# EAGLE design lp_small (EAGLE 7.5.0)
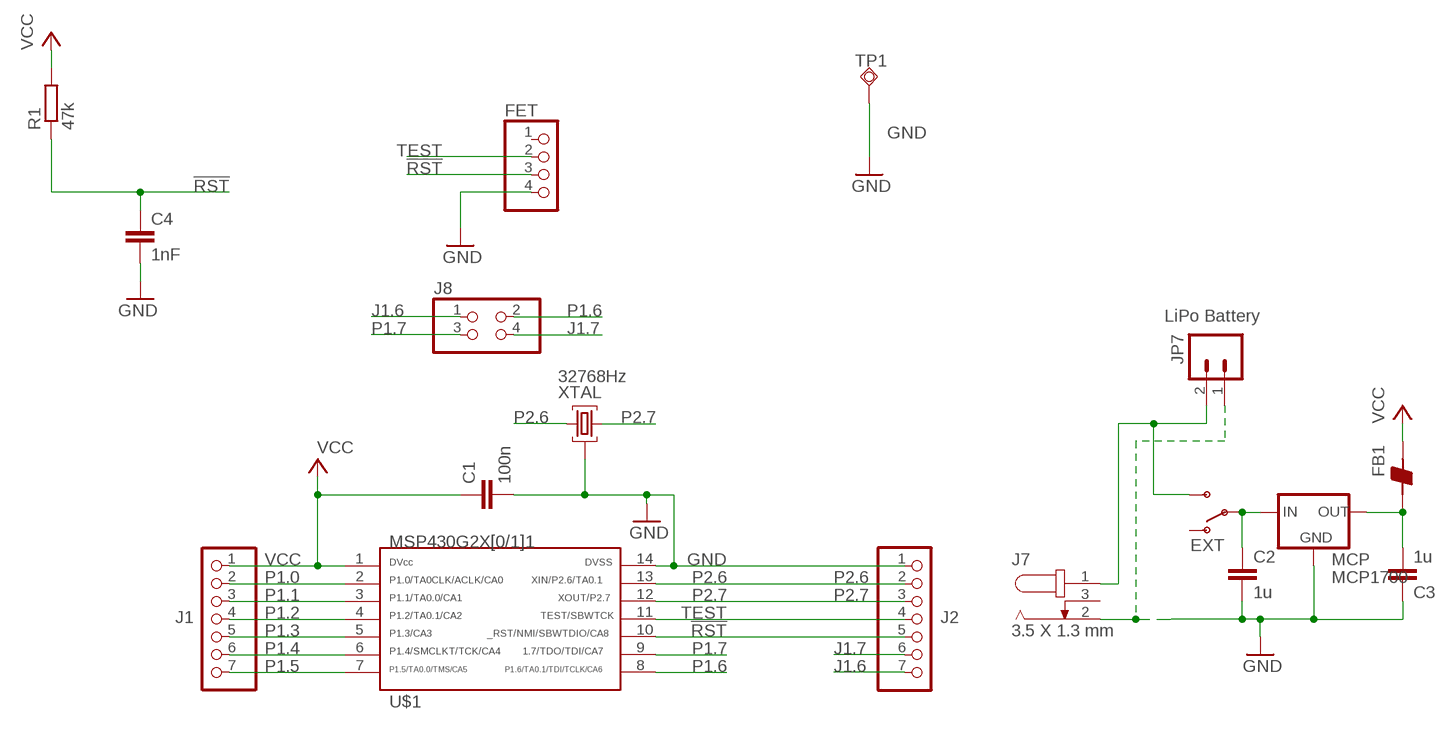
[diagram p0: schematic, sheet 1]

## Parts
C1  100n  C-EUC0805  [C0805]
C2  1u  C-EUC0805  [C0805]
C3  1u  C-EUC0805  [C0805]
C4  1nF  C-EUC0805  [C0805]
FB1  BEAD-0805  [0805]
FET  PINHD-1X4  [1X04]
J1  PINHD-1X7  [1X07]
J2  PINHD-1X7  [1X07]
J7  3.5 X 1.3 mm  DC_JACK_3.5X1.3MM  [3.5X1.3MM_DC_JACK]
J8  PINHD-2X2  [2X02]
JP7  LiPo Battery  M02JST-PTH-2  [JST-2-PTH]
MCP  MCP1700  MCP1700SOT-23  [SOT-23]
ON  EXT  SWITCH-SPSTPTH  [SWITCH-SPDT]
R1  47k  R-EU_R0805  [R0805]
TP1  TPSQTP20R  [TP20R]
U$1  G2X[0/1]1---N14  [N14]
XTAL  32768Hz  QUARZ5  [QUARZ5]

## Nets
!RST: C4.1 FET.3 J2.5 R1.1 U$1.10
GND [GND]: C1.2 C2.2 C3.1 C4.2 FET.4 J2.1 J7.2 JP7.1 MCP.1(GND) TP1.TP U$1.14 XTAL.GND@0
J1.6: J2.7 J8.1
J1.7: J2.6 J8.4
N$3 [VCC]: C2.1 MCP.3(IN) ON.2(P)
N$6 [VCC]: C3.2 FB1.1 MCP.2(OUT)
P1.0: J1.2 U$1.2
P1.1: J1.3 U$1.3
P1.2: J1.4 U$1.4
P1.3: J1.5 U$1.5
P1.4: J1.6 U$1.6
P1.5: J1.7 U$1.7
P1.6: J8.2 U$1.8
P1.7: J8.3 U$1.9
P2.6: J2.2 U$1.13 XTAL.2
P2.7: J2.3 U$1.12 XTAL.1
TEST: FET.2 J2.4 U$1.11
VCC [VCC]: C1.1 FB1.2 J1.1 R1.2 U$1.1
VCCEXT [VCC]: J7.1 JP7.2 ON.3(S)
Unconnected: FET.1 J7.3 ON.1(O)

## Library data of the parts
C1-C3 = rcl:C-EU: CAPACITOR, European symbol
C4 = resistor:C-EU: CAPACITOR, European symbol
FB1 = CH_passive:BEAD
FET = pinhead:PINHD-1X4: PIN HEADER
J1 J2 = pinhead:PINHD-1X7: PIN HEADER
J7 = MY_CONN:DC_JACK_3.5X1.3MM
J8 = pinhead:PINHD-2X2: PIN HEADER
JP7 = SparkFun:M02: Header 2 Standard 2-pin 0.1" header. Use with straight break away headers (SKU : PRT-00116), right angle break away headers (PRT-00553), swiss pins (PRT-00743), machine pins (PRT-00117), and female headers (PRT-00115). Molex polarized connector foot print use with SKU : PRT-08233 with associated crimp pins and housings.
MCP = MY_IC:MCP1700
ON = SparkFun:SWITCH-SPST: SPST Switch Simple slide switch. Spark Fun Electronics SKU : COM-00102
R1 = resistor:R-EU_: RESISTOR, European symbol
TP1 = testpad:TPSQ: Test pad
U$1 = TI_MSP430_v16:G2X[0/1]1---N14: MSP430G2X[0/1]1 MSP430G2001, MSP430G2101, MSP430G2201,MSP430G2111, G2211 PDIP (N) 14 Pin Package http://focus.ti.com/docs/prod/folders/print/msp430g2111.html
XTAL = my_xtal:QUARZ5

## Net classes
0 default: width 0.406 mm, drill 0.508 mm
1 GND: width 0.508 mm, drill 0.508 mm
2 VCC: width 1.016 mm, drill 0.508 mm
4 VCCEXT: width 0.762 mm, drill 0.508 mm, clearance 0.229 mm

## Board
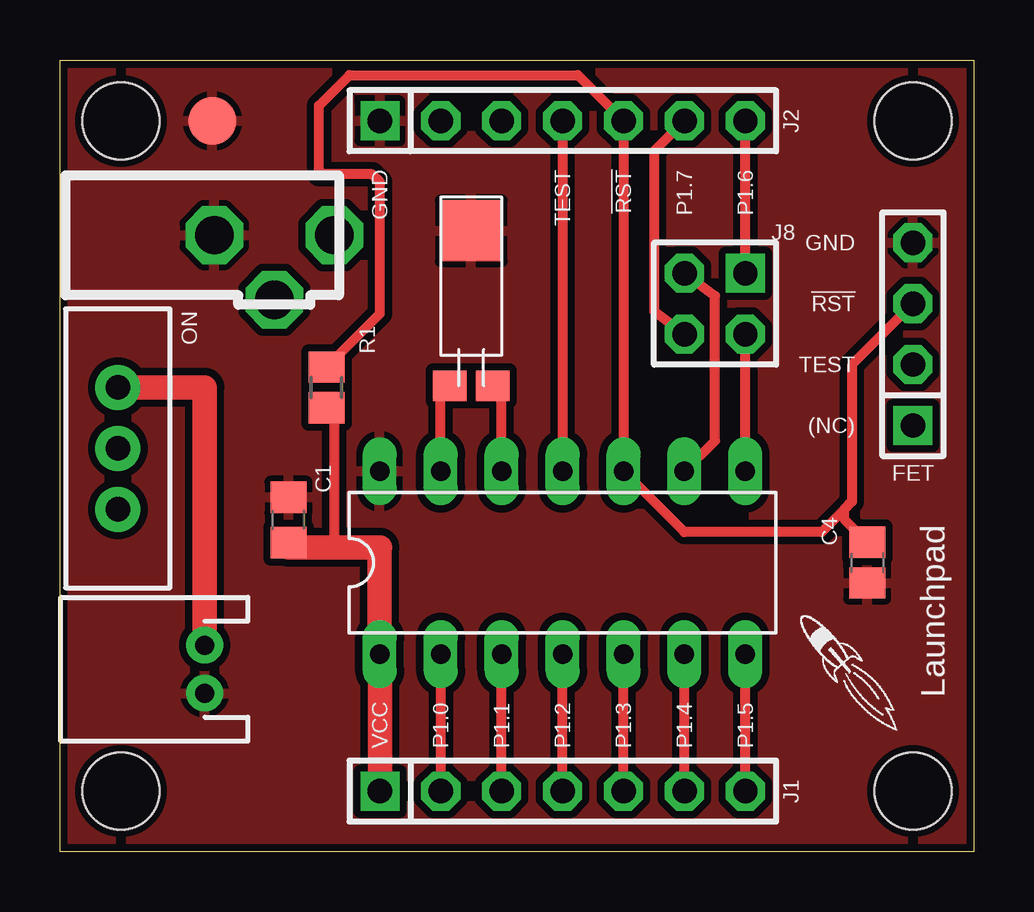
[diagram p1: board, top side]
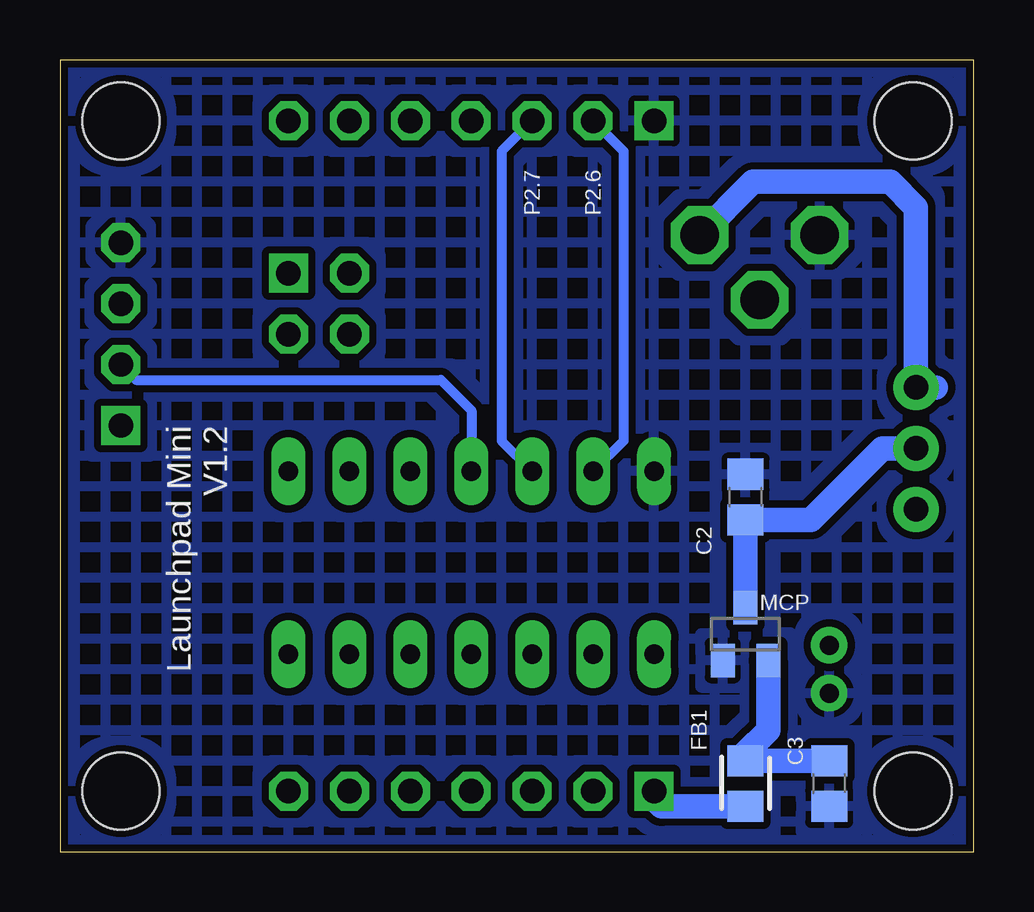
[diagram p2: board, bottom side, seen from below]

Size 38.1 x 33.02 mm. Coordinates in mm from the lower left corner, seen from the top.
Outline: 0,33.02 38.1,33.02 38.1,0 0,0 0,33.02
Copper layers (1*16): Top 0.035mm / dielectric 1.5mm / Bottom 0.035mm
Design rules "SparkFun": minimum track width 8mil, minimum drill 20mil, track to track 8mil, track to pad 8mil, pad to pad 8mil, via to via 8mil, smd to smd 8mil, copper to edge 10mil, drill to drill 8mil, minimum pad ring 12mil, minimum via ring 10mil, stop-mask expansion 4mil, vias tented up to drill 25mil, thermal gap 10mil
Holes 3.2 mm at 2.54,30.48 35.56,30.48 35.56,2.54 2.54,2.54

### Footprints (pad centres in the part's own frame; a part is rotated, then mirrored left to right if it is on the bottom)
C0805 = smd 1.3 x 1.5: 1 -0.95,0; 2 0.95,0
C0805' = smd 1.3 x 1.5: 1 -0.85,0; 2 0.85,0
0805 = smd 1.3 x 1.5: 1 -0.95,0; 2 0.95,0
1X04 = drill 1.016 square: 1 -3.81,0 | drill 1.016 octagon: 2 -1.27,0; 3 1.27,0; 4 3.81,0
1X07 = drill 1.016 square: 1 -7.62,0 | drill 1.016 octagon: 2 -5.08,0; 3 -2.54,0; 4 0,0; 5 2.54,0; 6 5.08,0; 7 7.62,0
3.5X1.3MM_DC_JACK = drill 1.6 octagon: 1 0,0; 2 -5,0; 3 -2.5,-2.7
2X02 = drill 1.016 square: 1 -1.27,-1.27 | drill 1.016 octagon: 2 -1.27,1.27; 3 1.27,-1.27; 4 1.27,1.27
JST-2-PTH = drill 0.787 pad 1.524: 1 -1,0; 2 1,0
SOT-23 = smd 1 x 1.4: 1 -0.95,-1.1; 2 0.95,-1.1; 3 0,1.1
SWITCH-SPDT = drill 1.016 pad 1.88: 1 0,2.54; 2 0,0; 3 0,-2.54
R0805 = smd 1.3 x 1.5: 1 -0.85,0; 2 0.85,0
TP20R = smd 2 x 2: TP 0,0
N14 = drill 0.813 long: 1 -7.625,-3.81; 2 -5.085,-3.81; 3 -2.545,-3.81; 4 -0.005,-3.81; 5 2.535,-3.81; 6 5.075,-3.81; 7 7.615,-3.81; 8 7.615,3.81; 9 5.075,3.81; 10 2.535,3.81; 11 -0.005,3.81; 12 -2.545,3.81; 13 -5.085,3.81; 14 -7.625,3.81
QUARZ5 = smd 1.27 x 1.397: 1 0,0.889; 2 0,-0.889 | smd 2.54 x 2.54: GND@0 -6.465,0

### Placement (x,y rotation side)
C1  9.53,13.84 90 top
C2  9.53,14.8 90 bottom
C3  6.03,2.86 90 bottom
C4  1nF  [C0805']  33.66,12.06 270 top
FB1  9.53,2.86 270 bottom
FET  35.56,21.59 90 top
J1  20.95,2.54 0 top
J2  20.95,30.48 0 top
J7  11.43,25.72 0 top
J8  27.3,22.86 180 top
JP7  6.03,7.62 90 top
MCP  9.53,9.08 0 bottom
ON  2.41,16.83 180 top
R1  11.11,19.37 270 top
TP1  6.35,30.48 0 top
U$1  20.95,12.06 0 top
U$2  [LOGO-ROCKET]  32.7,7.62 90 top
XTAL  17.14,19.43 270 top

### Tracks (layer width: path | path; a pad name or v marks a point on that pad's centre or on a via)
!RST
  Top 0.406: 32.7,14.29 33.02,14.61 33.02,20.32 FET.3 | 32.7,14.29 31.75,13.34 26.03,13.34 U$1.10 J2.5 21.59,32.38 12.07,32.38 10.79,31.11 10.79,28.26 13.02,28.26 13.34,27.94 13.34,22.44 R1.1 | C4.1 32.7,13.87 32.7,14.29
GND
  pour Top (isolate 0.305): -0.89,-0.51 39.75,-0.51 39.75,34.16 -0.89,34.16
  pour Bottom (isolate 0.305, hatched): -0.89,-0.51 39.75,-0.51 39.75,34.16 -0.89,34.16
J1.6
  Top 0.406: J8.1 J2.7
J1.7
  Top 0.406: J2.6 24.77,29.21 24.77,22.54 J8.4
N$3
  Bottom 1.016: ON.2 3.81,16.83 6.79,13.85 C2.1 MCP.3
N$6
  Bottom 1.016: MCP.2 8.57,5.08 9.53,4.13 FB1.1 C3.2
P1.0
  Top 0.406: J1.2 U$1.2
P1.1
  Top 0.406: J1.3 U$1.3
P1.2
  Top 0.406: J1.4 U$1.4
P1.3
  Top 0.406: J1.5 U$1.5
P1.4
  Top 0.406: J1.6 U$1.6
P1.5
  Top 0.406: J1.7 U$1.7
P1.6
  Top 0.406: U$1.8 J8.2
P1.7
  Top 0.406: J8.3 27.3,23.18 27.3,17.14 U$1.9
P2.6
  Top 0.406: 15.88,19.05 XTAL.2 15.87,19.05 U$1.13
  Bottom 0.406: J2.2 14.61,29.21 14.61,17.14 U$1.13
P2.7
  Top 0.406: XTAL.1 18.41,19.05 U$1.12
  Bottom 0.406: J2.3 19.68,29.21 19.68,17.14 U$1.12
TEST
  Top 0.406: J2.4 U$1.11
  Bottom 0.406: FET.2 34.92,19.68 22.22,19.68 20.95,18.41 U$1.11 20.95,17.14
VCC
  Top 0.406: R1.2 11.43,18.2 11.43,12.7
  Top 1.016: C1.1 9.53,12.7 11.43,12.7 13.34,12.7 13.33,12.7 U$1.1 J1.1
  Bottom 1.016: FB1.2 13.02,1.91 13.34,2.22 J1.1
VCCEXT
  Top 1.016: JP7.2 6.03,19.37 ON.3
  Bottom 1.016: J7.1 9.21,27.94 3.49,27.94 2.41,26.86 ON.3 1.59,19.37

### Text on the board
tPlace: Launchpad
bPlace: Launchpad Mini / V1.2
tNames: GND | TEST | !RST | P1.7 | P1.6 | GND | !RST | ON | TEST | (NC) | VCC | P1.0 | P1.1 | P1.2 | P1.3 | P1.4 | P1.5
bNames: P2.6 | P2.7